# Altium project JBC_PD_Soldering_Iron.PrjPcb
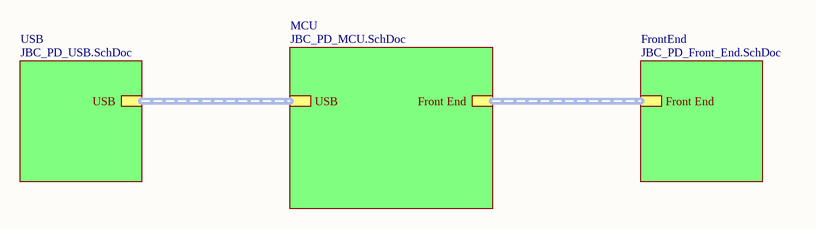
[diagram p0: JBC_PD_Top.SchDoc]
4 sheets, 83 parts. Net scope: hierarchical (ports join the sheet entries above them; power ports are global).
Board file: JBC_PD.PcbDoc
Sheets:
  JBC_PD_Top.SchDoc
    MCU = JBC_PD_MCU.SchDoc
    FrontEnd = JBC_PD_Front_End.SchDoc
    USB = JBC_PD_USB.SchDoc

## Sheet JBC_PD_Top.SchDoc
size A4

### Sub-sheets
FrontEnd = JBC_PD_Front_End.SchDoc: Front End (harness Front End)
MCU = JBC_PD_MCU.SchDoc: USB (harness USB), Front End (harness Front End)
USB = JBC_PD_USB.SchDoc: USB (harness USB)

### Buses and harness runs
harness sheet FrontEnd/Front End = sheet MCU/Front End
harness sheet MCU/USB = sheet USB/USB

## Sheet JBC_PD_MCU.SchDoc
size A4
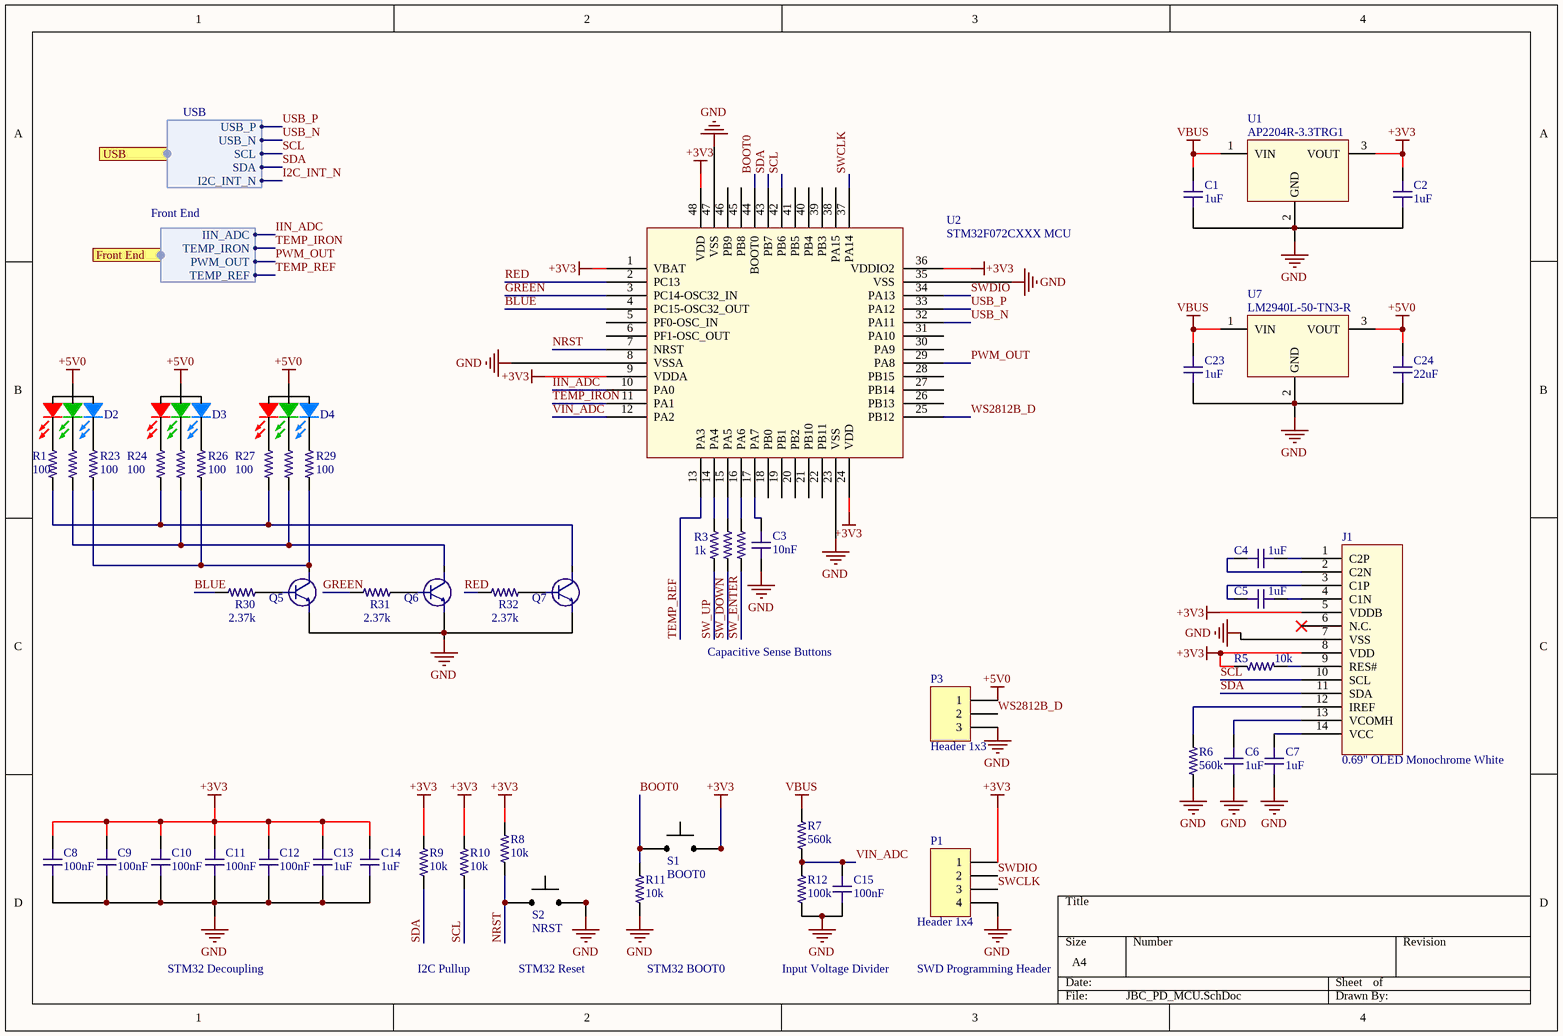
[diagram p1: JBC_PD_MCU.SchDoc]

### Parts
C1  value 1uF  [C0603-IPC]  (hidden comment: C0603 1uF 25V X7R)
C2  value 1uF  [C0603-IPC]  (hidden comment: C0603 1uF 25V X7R)
C3  value 10nF  [C0603-IPC]  (hidden comment: Cs 10nF 50V X7R)
C4  value 1uF  [C0603-IPC]  (hidden comment: C0603 1uF 25V X7R)
C5  value 1uF  [C0603-IPC]  (hidden comment: C0603 1uF 25V X7R)
C6  value 1uF  [C0603-IPC]  (hidden comment: C0603 1uF 25V X7R)
C7  value 1uF  [C0603-IPC]  (hidden comment: C0603 1uF 25V X7R)
C8  value 100nF  [C0603-IPC]  (hidden comment: C0603 100nF 25V X7R)
C9  value 100nF  [C0603-IPC]  (hidden comment: C0603 100nF 25V X7R)
C10  value 100nF  [C0603-IPC]  (hidden comment: C0603 100nF 25V X7R)
C11  value 100nF  [C0603-IPC]  (hidden comment: C0603 100nF 25V X7R)
C12  value 100nF  [C0603-IPC]  (hidden comment: C0603 100nF 25V X7R)
C13  value 1uF  [C0603-IPC]  (hidden comment: C0603 1uF 25V X7R)
C14  value 1uF  [C0603-IPC]  (hidden comment: C0603 1uF 25V X7R)
C15  value 100nF  [C0603-IPC]  (hidden comment: C0603 100nF 25V X7R)
C23  value 1uF  [C0603-IPC]  (hidden comment: C0603 1uF 25V X7R)
C24  value 22uF  [C0603-IPC]  (hidden comment: C0603 22uF 10V X5R)
D2  RGB  [LED_0606_RGB_WURTH - Reverse Mount]  (value not drawn)
D3  RGB  [LED_0606_RGB_WURTH - Reverse Mount]  (value not drawn)
D4  RGB  [LED_0606_RGB_WURTH - Reverse Mount]  (value not drawn)
J1  0.69" OLED Monochrome White  [OLED_64x32 Bent]
P1  Header 1x4  [HEADER 1X4 SMD 2.54mm]
P3  Header 1x3  [HEADER 1X3 SMD 2.54mm]
Q5  MMBT3904LT1G  [SOT23-MMBT3904]  (value not drawn)
Q6  MMBT3904LT1G  [SOT23-MMBT3904]  (value not drawn)
Q7  MMBT3904LT1G  [SOT23-MMBT3904]  (value not drawn)
R1  value 100  [R0603-IPC]  (hidden comment: R0603 100 1%)
R2  R0603 1K 1%  [R0603-IPC]  (value not drawn)
R3  value 1k  [R0603-IPC]  (hidden comment: R0603 1K 1%)
R4  R0603 1K 1%  [R0603-IPC]  (value not drawn)
R5  value 10k  [R0603-IPC]  (hidden comment: R0603 10K 1%)
R6  value 560k  [R0603-IPC]  (hidden comment: R0603 560K 1%)
R7  value 560k  [R0603-IPC]  (hidden comment: R0603 560K 1%)
R8  value 10k  [R0603-IPC]  (hidden comment: R0603 10K 1%)
R9  value 10k  [R0603-IPC]  (hidden comment: R0603 10K 1%)
R10  value 10k  [R0603-IPC]  (hidden comment: R0603 10K 1%)
R11  value 10k  [R0603-IPC]  (hidden comment: R0603 10K 1%)
R12  value 100k  [R0603-IPC]  (hidden comment: R0603 100K 1%)
R22  R0603 100 1%  [R0603-IPC]  (value not drawn)
R23  value 100  [R0603-IPC]  (hidden comment: R0603 100 1%)
R24  value 100  [R0603-IPC]  (hidden comment: R0603 100 1%)
R25  R0603 100 1%  [R0603-IPC]  (value not drawn)
R26  value 100  [R0603-IPC]  (hidden comment: R0603 100 1%)
R27  value 100  [R0603-IPC]  (hidden comment: R0603 100 1%)
R28  R0603 100 1%  [R0603-IPC]  (value not drawn)
R29  value 100  [R0603-IPC]  (hidden comment: R0603 100 1%)
R30  value 2.37k  [R0603-IPC]  (hidden comment: R0603 2.37K 1%)
R31  value 2.37k  [R0603-IPC]  (hidden comment: R0603 2.37K 1%)
R32  value 2.37k  [R0603-IPC]  (hidden comment: R0603 2.37K 1%)
S1  BOOT0  [TL3342F260QG]
S2  NRST  [TL3342F260QG]
U1  AP2204R-3.3TRG1  [SOT-89]
U2  STM32F072CXXX MCU  [LQFP48]
U7  LM2940L-50-TN3-R  [DPAK2]

### Ports
Front End (harness Front End), USB (harness USB)

### Harnesses
USB: USB_P, USB_N, SCL, SDA, I2C_INT_N
Front End: IIN_ADC, TEMP_IRON, PWM_OUT, TEMP_REF

### Nets
+3V3: C2.1 C8.2 C9.2 C10.2 C11.2 C12.2 C13.1 C14.1 J1.5(VDDB) J1.8(VDD) P1.1 R5.1 R8.2 R9.2 R10.2 S1.1 S1.2 U1.3(VOUT) U2.1(VBAT) U2.9(VDDA) U2.24(VDD) U2.36(VDDIO2) U2.48(VDD)
+5V0: C24.2 D2.A D3.A D4.A P3.1 U7.3(VOUT)
GND: C1.2 C2.2 C3.1 C6.2 C7.2 C8.1 C9.1 C10.1 C11.1 C12.1 C13.2 C14.2 C15.1 C23.2 C24.1 J1.7(VSS) P1.4 P3.3 Q5.2(E) Q6.2(E) Q7.2(E) R6.1 R11.1 R12.1 S2.1 S2.2 U1.2(GND) U2.8(VSSA) U2.23(VSS) U2.35(VSS) U2.47(VSS) U7.2(GND)
VBUS: C1.1 C23.1 R7.2 U1.1(VIN) U7.1(VIN)
BLUE: R30.1 U2.4(PC15-OSC32_OUT)
BOOT0: R11.2 S1.3 S1.4 U2.44(BOOT0)
GREEN: R31.1 U2.3(PC14-OSC32_IN)
IIN_ADC: U2.10(PA0) ; port Front End.IIN_ADC
NRST: R8.1 S2.3 S2.4 U2.7(NRST)
PWM_OUT: U2.29(PA8) ; port Front End.PWM_OUT
RED: R32.1 U2.2(PC13)
SCL: J1.10(SCL) R10.1 U2.42(PB6) ; port USB.SCL
SDA: J1.11(SDA) R9.1 U2.43(PB7) ; port USB.SDA
SW_DOWN: R2.1
SW_ENTER: R4.1
SW_UP: R3.1
SWCLK: P1.3 U2.37(PA14)
SWDIO: P1.2 U2.34(PA13)
TEMP_IRON: U2.11(PA1) ; port Front End.TEMP_IRON
TEMP_REF: U2.13(PA3) ; port Front End.TEMP_REF
USB_N: U2.32(PA11) ; port USB.USB_N
USB_P: U2.33(PA12) ; port USB.USB_P
VIN_ADC: C15.2 R7.1 R12.2 U2.12(PA2)
WS2812B_D: P3.2 U2.25(PB12)
NetC3_2: C3.2 U2.17(PA7)
NetC4_1: C4.1 J1.2(C2N)
NetC4_2: C4.2 J1.1(C2P)
NetC5_1: C5.1 J1.3(C1P)
NetC5_2: C5.2 J1.4(C1N)
NetC6_1: C6.1 J1.13(VCOMH)
NetC7_1: C7.1 J1.14(VCC)
NetD2_BK: D2.BK R23.2
NetD2_GK: D2.GK R22.2
NetD2_RK: D2.RK R1.2
NetD3_BK: D3.BK R26.2
NetD3_GK: D3.GK R25.2
NetD3_RK: D3.RK R24.2
NetD4_BK: D4.BK R29.2
NetD4_GK: D4.GK R28.2
NetD4_RK: D4.RK R27.2
NetJ1_9: J1.9(RES#) R5.2
NetJ1_12: J1.12(IREF) R6.2
NetQ5_1: Q5.1(B) R30.2
NetQ5_3: Q5.3(C) R23.1 R26.1 R29.1
NetQ6_1: Q6.1(B) R31.2
NetQ6_3: Q6.3(C) R22.1 R25.1 R28.1
NetQ7_1: Q7.1(B) R32.2
NetQ7_3: Q7.3(C) R1.1 R24.1 R27.1
NetR2_2: R2.2 U2.15(PA5)
NetR3_2: R3.2 U2.14(PA4)
NetR4_2: R4.2 U2.16(PA6)

Not connected (* = marked no-connect by the designer): J1 6(N.C.)*; U2 5(PF0-OSC_IN) 6(PF1-OSC_OUT) 18(PB0) 19(PB1) 20(PB2) 21(PB10) 22(PB11) 26(PB13) 27(PB14) 28(PB15) 30(PA9) 31(PA10) 38(PA15) 39(PB3) 40(PB4) 41(PB5) 45(PB8) 46(PB9)

### Notes on the sheet
- Capacitive Sense Buttons
- STM32 Decoupling
- I2C Pullup
- STM32 Reset
- STM32 BOOT0
- Input Voltage Divider
- SWD Programming Header

### Library data of the parts
C1 C2 C4-C7 C13 C14 C23 = C0603 1uF 25V X7R: CAP CER 1UF 25V X7R 0603; EIA Code: X7R; Max. Voltage: 25V; Features: Soft Termination; Supplier 1: Digi-Key; Supplier Part Number 1: 445-173615-1-ND
C3 = C0603 10nF 50V X7R: CAP CER 10000PF 50V X7R 0603; EIA Code: X7R; Max. Voltage: 50V; Features: Soft Termination; Supplier 1: Digi-Key; Supplier Part Number 1: 490-10892-1-ND
C8-C12 C15 = C0603 100nF 25V X7R: Chip Capacitor, 0603, 100nF, 25V, X7R; EIA Code: X7R; Max. Voltage: 25V; Supplier 1: Digi-Key; Supplier Part Number 1: 490-1524-1-ND
C24 = C0603 22uF 10V X5R: Chip Capacitor, 0603, 22uF, 10V, X5R; EIA Code: X5R; Max. Voltage: 10V; Supplier 1: Digi-Key; Supplier Part Number 1: 490-10476-1-ND
D2-D4 = Led_RGB_0606: RGB Led 1.6 x 1.6 mm Diffused; Manufacturer: Everlight; Manufacturer Part Number: 19-237/R6GHBHW-C01/2T; Supplier 1: Digi-Key; Supplier Part Number 1: 1080-1590-1-ND
J1 = OLED_64x32: 0.69" OLED Direct Solder Monochrome White; Manufacturer Part Number: UG-9616TSWCG02; Supplier 1: LCSC; Supplier Part Number 1: C88335
P1 = Header 1x4: Header, 4-Pin; LatestRevisionDate: 17-Jul-2002; LatestRevisionNote: Re-released for DXP Platform.; Publisher: Altium Limited
P3 = Header 1x3: Header, 3-Pin; LatestRevisionDate: 17-Jul-2002; LatestRevisionNote: Re-released for DXP Platform.; Publisher: Altium Limited
Q5-Q7 = MMBT3904LT1G: Bipolar (BJT) Transistor NPN 40V 200mA 300MHz 300mW Surface Mount SOT-23-3 (TO-236); I_max: 200mA; V_brkdown: 40V; Supplier 1: Digi-Key; Supplier 2: Mouser; Supplier 3: LCSC; Supplier Part Number 1: MMBT3904LT1GOSDKR-ND; Supplier Part Number 2: 863-MMBT3904LT1G; Supplier Part Number 3: C81464
R1 R23 R24 R26 R27 R29 = R0603 100 1%: RES SMD 100 OHM 1% 1/4W 0603; Power (Watts): 0.25W, 1/4W; Supplier 1: Digi-Key; Supplier Part Number 1: 541-3244-1-ND
R2-R4 = R0603 1K 1%: RES SMD 1K OHM 1% 1/10W 0603; Temperature Coefficient: ±100ppm/°C; Operating Temperature: -55°C ~ 155°C; Features: Automotive AEC-Q200; Tolerance: ±1%; Supplier 1: Digi-Key; Supplier Part Number 1: RMCF0603FG1K00CT-ND
  R2 R4: Value: 1k
R5 R8-R11 = R0603 10K 1%: RES SMD 10K OHM 1% 1/10W 0603; Supplier 1: Digi-Key; Supplier Part Number 1: RMCF0603FT10K0CT-ND
R6 R7 = R0603 560K 1%: RES 560K OHM 1% 1/10W 0603; Supplier 1: Digi-Key; Supplier Part Number 1: RMCF0603FT560KCT-ND
R12 = R0603 100K 1%: RES SMD 100K OHM 1% 1/10W 0603; Supplier 1: Digi-Key; Supplier Part Number 1: RMCF0603FT100KCT-ND
R22 R25 R28 = R0603 100 1%: RES SMD 100 OHM 1% 1/4W 0603; Power (Watts): 0.25W, 1/4W; Value: 100; Supplier 1: Digi-Key; Supplier Part Number 1: 541-3244-1-ND
R30-R32 = R0603 2.37K 1%: RES SMD 2.37K OHM 1% 1/10W 0603; Supplier 1: Digi-Key; Supplier 2: Mouser; Supplier 3: LCSC; Supplier Part Number 3: C403087; Supplier Part Number 2: 667-ERJ-3EKF2371V; Supplier Part Number 1: P2.37KHCT-ND
S1 S2 = SWITCH TACTILE SPST: SWITCH TACTILE SPST-NO 0.05A 12V; Manufacturer Part Number: TL3342F260QG; Supplier 1: Digi-Key; Supplier Part Number 1: EG5470CT-ND
U1 = AP2204R: Fixed 24V 3.3V 150mA SOT-89(SOT-89-3) Low Dropout Regulators(LDO); Supplier 1: Digi-Key; Supplier 2: Mouser; Supplier 3: LCSC; Supplier Part Number 1: AP2204R-3.3TRG1DICT-ND; Supplier Part Number 2: 621-AP2204R-3.3TRG1; Supplier Part Number 3: C156303
U2 = STM32F072CXXX: 32-Bit FLASH ARM® Cortex®-M0 48MHz 1.65V ~ 3.6V LQFP-48_7x7x05P ST Microelectronics RoHS; Supplier 1: Digi-Key; Supplier 2: Mouser; Supplier 3: LCSC; Supplier Part Number 1: 497-18747-1-ND; Supplier Part Number 2: 511-STM32F072CBT6TR; Supplier Part Number 3: C81720
U7 = LM2940L-50-TN3-R: Fixed 26V 5V 1A TO-252-2(DPAK) Low Dropout Regulators(LDO); Supplier 3: LCSC; Supplier Part Number 3: C85225

## Sheet JBC_PD_Front_End.SchDoc
size A4
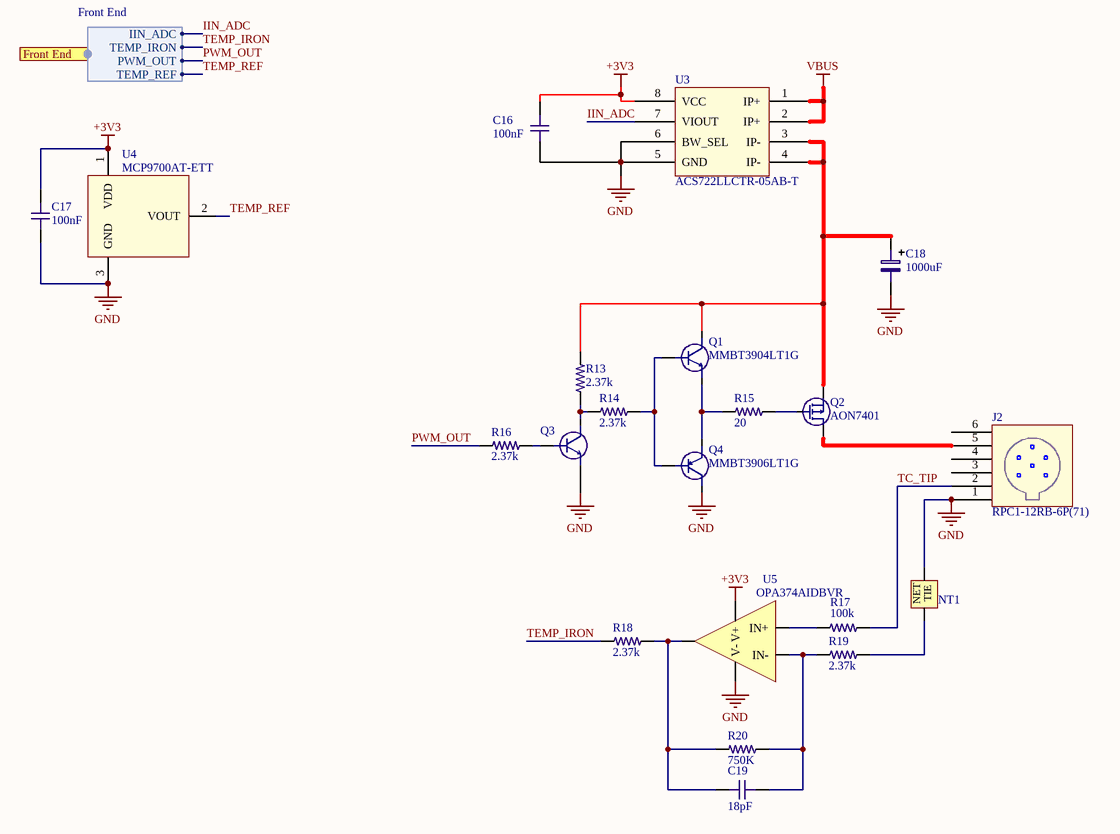
[diagram p2: JBC_PD_Front_End.SchDoc]

### Parts
C16  value 100nF  [C0603-IPC]  (hidden comment: C0603 100nF 25V X7R)
C17  value 100nF  [C0603-IPC]  (hidden comment: C0603 100nF 25V X7R)
C18  value 1000uF  [C-POLARIZED-5-12.5 Horizontal]  (hidden comment: 35ZLH1000MEFC12.5X20)
C19  value 18pF  [C0402-IPC]  (hidden comment: C0402 18pF 50V C0G_1)
J2  RPC1-12RB-6P(71)  [HIROSE RPC 1 SMD (WIRE)]
NT1  Net Tie  [NET_TIE]  (value not drawn)  (net tie, no BOM)
Q1  MMBT3904LT1G  [SOT23-MMBT3904]
Q2  AON7401  [DFN3x3A_8L_EP1_P]
Q3  MMBT3904LT1G  [SOT23-MMBT3904]  (value not drawn)
Q4  MMBT3906LT1G  [SOT23-Generic]
R13  value 2.37k  [R0603-IPC]  (hidden comment: R0603 2.37K 1%)
R14  value 2.37k  [R0603-IPC]  (hidden comment: R0603 2.37K 1%)
R15  value 20  [R1206-IPC]  (hidden comment: R1206 20 1%)
R16  value 2.37k  [R0603-IPC]  (hidden comment: R0603 2.37K 1%)
R17  value 100k  [R0603-IPC]  (hidden comment: R0603 100K 1%)
R18  value 2.37k  [R0603-IPC]  (hidden comment: R0603 2.37K 1%)
R19  value 2.37k  [R0603-IPC]  (hidden comment: R0603 2.37K 1%)
R20  value 750K  [R0603-IPC]  (hidden comment: RC0603FR-07750KL)
U3  ACS722LLCTR-05AB-T  [SOIC127P600X175-8N]
U4  MCP9700AT-ETT  [SOT23]
U5  OPA374AIDBVR  [DBV0005A]

### Ports
Front End (harness Front End)

### Harnesses
Front End: IIN_ADC, TEMP_IRON, PWM_OUT, TEMP_REF

### Nets
+3V3: C16.2 C17.2 U3.8(VCC) U4.1(VDD) U5.5(V+)
GND: C16.1 C17.1 C18.2 J2.1 NT1.2 Q3.2(E) Q4.3(C) U3.5(GND) U3.6(BW_SEL) U4.3(GND) U5.2(V-)
VBUS: U3.1(IP+) U3.2(IP+)
IIN_ADC: U3.7(VIOUT) ; port Front End.IIN_ADC
PWM_OUT: R16.1 ; port Front End.PWM_OUT
TC_TIP: J2.2 R17.1
TEMP_IRON: R18.1 ; port Front End.TEMP_IRON
TEMP_REF: U4.2(VOUT) ; port Front End.TEMP_REF
NetC18_1: C18.1 Q1.3(C) Q2.S R13.2 U3.3(IP-) U3.4(IP-)
NetC19_1: C19.1 R18.2 R20.1 U5.1(VOUT)
NetC19_2: C19.2 R19.1 R20.2 U5.4(IN-)
NetJ2_5: J2.5 Q2.D
NetNT1_1: NT1.1 R19.2
NetQ1_1: Q1.1(B) Q4.1(B) R14.2
NetQ1_2: Q1.2(E) Q4.2(E) R15.1
NetQ2_G: Q2.G R15.2
NetQ3_1: Q3.1(B) R16.2
NetQ3_3: Q3.3(C) R13.1 R14.1
NetR17_2: R17.2 U5.3(IN+)

Not connected (* = marked no-connect by the designer): J2 3 4 6

### Notes on the sheet
- (in symbol Net Tie) TIE; NET

### Library data of the parts
C16 C17 = C0603 100nF 25V X7R: Chip Capacitor, 0603, 100nF, 25V, X7R; EIA Code: X7R; Max. Voltage: 25V; Supplier 1: Digi-Key; Supplier Part Number 1: 490-1524-1-ND
C18 = C-THT 1000uF 35V Electrolytic: 1000uF ±20% 35V 12.5x20 10000Hrs @ 105℃ Radial,12.5x20mm Aluminum Electrolytic Capacitors - Leaded RoHS; Supplier 1: Digi-Key; Supplier 2: Mouser; Supplier 3: LCSC; Supplier Part Number 1: 1189-1888-ND; Supplier Part Number 2: 232-LH1000MEFC125X20; Supplier Part Number 3: C338194
C19 = C0402 18pF 50V C0G_1: Chip Capacitor, 0402, 18pF, 25V, C0G; Max. Voltage: 25V; Supplier 1: Digi-Key; Supplier Part Number 1: 399-14427-1-ND; EIA Code: C0G
J2 = Hirose RPC1: 6 Position Circular Connector Receptacle, Male Pins Solder Cup (JBC Iron Conn); Supplier 1: Digi-Key; Supplier 2: Mouser; Supplier Part Number 1: HR1817-ND; Supplier Part Number 2: 798-RPC112RB6P71
Q1 Q3 = MMBT3904LT1G: as Q5 on sheet JBC_PD_MCU; I_max: 200mA; V_brkdown: 40V; Supplier 1: Digi-Key; Supplier 2: Mouser; Supplier 3: LCSC; Supplier Part Number 1: MMBT3904LT1GOSDKR-ND; Supplier Part Number 2: 863-MMBT3904LT1G; Supplier Part Number 3: C81464
Q2 = AON7401: P-Channel 30V 12A (Ta), 35A (Tc) 3.1W (Ta), 29W (Tc) Surface Mount 8-DFN (3x3); Supplier 1: Digi-Key; Supplier 3: LCSC; Supplier Part Number 3: C124890; Supplier Part Number 1: 785-1302-1-ND
Q4 = MMBT3906LT1G: Bipolar (BJT) Transistor PNP 40V 200mA 250MHz 300mW Surface Mount SOT-23-3 (TO-236); Supplier 1: Digi-Key; Supplier 2: Mouser; Supplier 3: LCSC; Supplier Part Number 1: MMBT3906LT1GOSCT-ND; Supplier Part Number 2: 863-MMBT3906LT1G; Supplier Part Number 3: C53444
R13 R14 R16 R18 R19 = R0603 2.37K 1%: RES SMD 2.37K OHM 1% 1/10W 0603; Supplier 1: Digi-Key; Supplier 2: Mouser; Supplier 3: LCSC; Supplier Part Number 3: C403087; Supplier Part Number 2: 667-ERJ-3EKF2371V; Supplier Part Number 1: P2.37KHCT-ND
R15 = R1206 20 1%: Chip Resistor, 1206, 20 ohms, 0.5W; Manufacturer: Stackpole Electronics Inc.; Manufacturer Part Number: RNCP1206FTD20R0; Supplier 1: Digi-Key; Supplier Part Number 1: RNCP1206FTD20R0CT-ND
R17 = R0603 100K 1%: RES SMD 100K OHM 1% 1/10W 0603; Supplier 1: Digi-Key; Supplier Part Number 1: RMCF0603FT100KCT-ND
R20 = R0603 750K 1%: RES SMD 750K OHM 1% 1/10W 0603; Temperature Coefficient: ±100ppm/°C; Tolerance: ±1%; Operating Temperature: -55°C ~ 155°C; Supplier 1: Digi-Key; Supplier 2: Mouser; Supplier 3: LCSC; Supplier Part Number 1: 311-750KHRCT-ND; Supplier Part Number 2: 603-RC0603FR-07750KL; Supplier Part Number 3: C137684
U3 = ACS722: Current Sensor 5A 1 Channel Hall Effect, Open Loop Bidirectional 8-SOIC (0.154", 3.90mm Width); Supplier 1: Digi-Key; Supplier Part Number 1: 620-1634-1-ND; Supplier 3: LCSC; Supplier Part Number 3: C116613
U4 = MCP9700AT-ETT: Temperature Sensor Analog, Local -40°C ~ 125°C 10mV/°C SOT-23-3; Supplier 1: Digi-Key; Supplier 2: Mouser; Supplier 3: LCSC; Supplier Part Number 1: MCP9700AT-E/TTCT-ND; Supplier Part Number 2: 579-MCP9700AT-E/TT; Supplier Part Number 3: C127949
U5 = OPA374: General Purpose 1 2.3V ~ 5.5V, ±1.15V ~ 2.75V 585uA 6.5MHz 5 V/us SOT-23-5 Precision OpAmps RoHS; Supplier 1: Digi-Key; Supplier 2: Mouser; Supplier 3: LCSC; Supplier Part Number 1: 296-39129-1-ND; Supplier Part Number 2: 595-OPA374AIDBVR; Supplier Part Number 3: C111859

## Sheet JBC_PD_USB.SchDoc
size A4
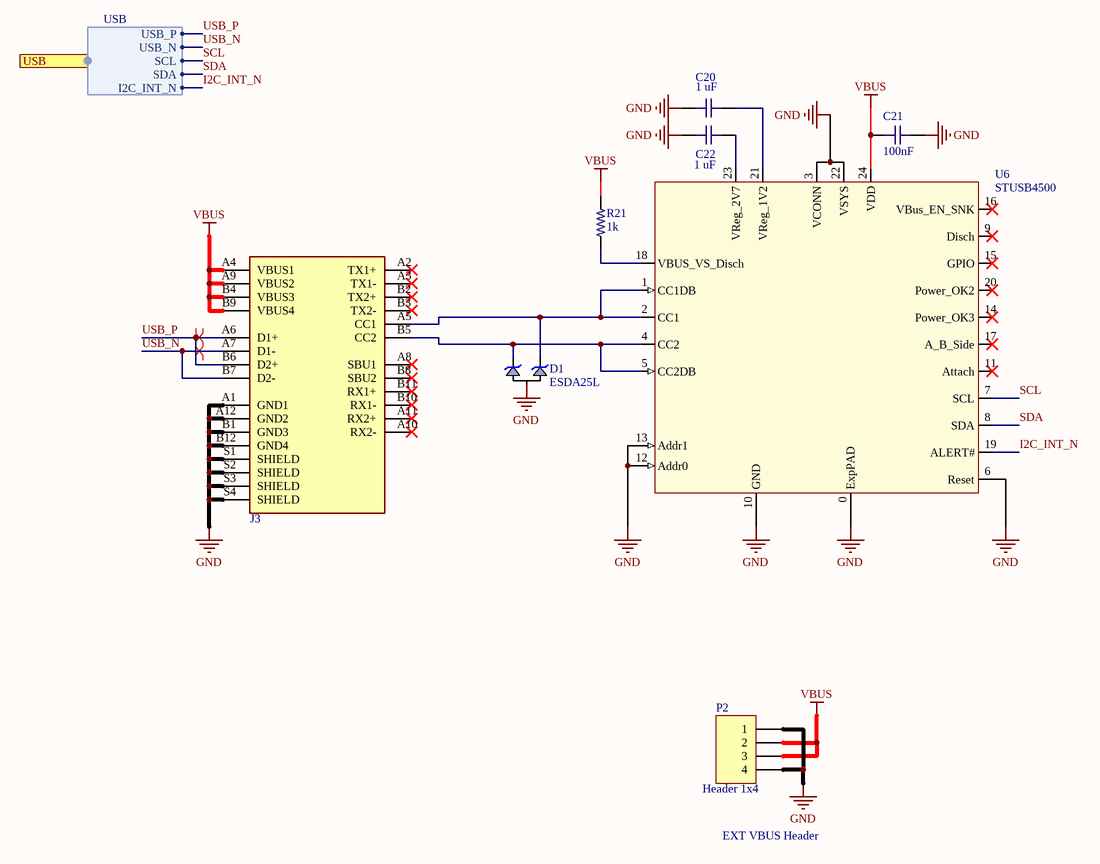
[diagram p3: JBC_PD_USB.SchDoc]

### Parts
C20  value 1 uF  [C0603-IPC]  (hidden comment: C0603 1uF 10V X7R)
C21  value 100nF  [C0603-IPC]  (hidden comment: C0603 100nF 25V X7R)
C22  value 1 uF  [C0603-IPC]  (hidden comment: C0603 1uF 10V X7R)
D1  ESDA25L  [SOT23-3L]
J3  USB C  [Molex USB-C]  (value not drawn)
P2  Header 1x4  [HEADER 1X4 SMD 2.54mm]
R21  value 1k  [R0603-IPC]  (hidden comment: R0603 1K 1%)
U6  STUSB4500  [QFN24 - 4X4MM - PITCH 0.5MM - EXPOSEDPAD]

### Ports
USB (harness USB)

### Harnesses
USB: USB_P, USB_N, SCL, SDA, I2C_INT_N

### Nets
GND: C20.1 C21.2 C22.1 D1.3(A) J3.A1(GND1) J3.A12(GND2) J3.B1(GND3) J3.B12(GND4) J3.S1(SHIELD) J3.S2(SHIELD) J3.S3(SHIELD) J3.S4(SHIELD) P2.1 P2.4 U6.0(ExpPAD) U6.3(VCONN) U6.6(Reset) U6.10(GND) U6.12(Addr0) U6.13(Addr1) U6.22(VSYS)
VBUS: C21.1 J3.A4(VBUS1) J3.A9(VBUS2) J3.B4(VBUS3) J3.B9(VBUS4) P2.2 P2.3 R21.2 U6.24(VDD)
I2C_INT_N: U6.19(ALERT#) ; port USB.I2C_INT_N
SCL: U6.7(SCL) ; port USB.SCL
SDA: U6.8(SDA) ; port USB.SDA
USB_N: J3.A7(D1-) J3.B7(D2-) ; port USB.USB_N
USB_P: J3.A6(D1+) J3.B6(D2+) ; port USB.USB_P
NetC20_2: C20.2 U6.21(VReg_1V2)
NetC22_2: C22.2 U6.23(VReg_2V7)
NetD1_1: D1.1(K1) J3.A5(CC1) U6.1(CC1DB) U6.2(CC1)
NetD1_2: D1.2(K2) J3.B5(CC2) U6.4(CC2) U6.5(CC2DB)
NetR21_1: R21.1 U6.18(VBUS_VS_Disch)

Not connected (* = marked no-connect by the designer): J3 A2(TX1+)* A3(TX1-)* A8(SBU1)* A10(RX2-)* A11(RX2+)* B2(TX2+)* B3(TX2-)* B8(SBU2)* B10(RX1-)* B11(RX1+)*; U6 9(Disch)* 11(Attach)* 14(Power_OK3)* 15(GPIO)* 16(VBus_EN_SNK)* 17(A_B_Side)* 20(Power_OK2)*

### Layout directives
differential pair: USB_N, USB_P

### Notes on the sheet
- EXT VBUS Header

### Library data of the parts
C20 C22 = C0603 1uF 10V X7R: Chip Capacitor, 0603, 1uF +/- 0.1uF, 10V, X7R; Supplier 1: Digi-Key; Supplier Part Number 1: 1276-1946-1-ND; Max. Voltage: 10V; EIA Code: X7R
C21 = C0603 100nF 25V X7R: Chip Capacitor, 0603, 100nF, 25V, X7R; EIA Code: X7R; Max. Voltage: 25V; Supplier 1: Digi-Key; Supplier Part Number 1: 490-1524-1-ND
D1 = ESDA25L: Dual Transil Array For ESD Protection in SOT23-3 Vbr = 25V; Manufacturer: STMicroelectronics; Supplier 1: Digi-Key; Supplier 2: Mouser; Supplier 3: LCSC; Supplier Part Number 1: 497-4642-1-ND; Supplier Part Number 2: 511-ESDA25L; Supplier Part Number 3: C95343; Manufacturer Part Number: ESDA25L
J3 = USB C: USB-C USB 3.1 Gen 2, Superspeed+_ Receptacle Connector 24 Position Surface Mount, Right Angle; Through Hole; MF: Molex; MP: 1054500101; Package: None; Digi-Key_Part_Number: WM12856CT-ND; SnapEDA_Link: https://www.snapeda.com/parts/1054500101/Molex/view-part/448528/?ref=snap; Digi-Key_Purchase_URL: https://www.digikey.tw/product-detail/en/molex/1054500101/WM12856CT-ND/5843891?utm_source=snapeda&utm_medium=aggregator&utm_campaign=symbol; Value: *; Supplier 1: Digi-Key; Supplier 2: Mouser; Supplier 3: LCSC; Supplier Part Number 1: WM12856CT-ND; Supplier Part Number 2: 538-105450-0101; Supplier Part Number 3: C134092
P2 = Header 1x4: Header, 4-Pin; LatestRevisionDate: 17-Jul-2002; LatestRevisionNote: Re-released for DXP Platform.; Publisher: Altium Limited
R21 = R0603 1K 1%: as R2 on sheet JBC_PD_MCU; Operating Temperature: -55°C ~ 155°C; Features: Automotive AEC-Q200; Tolerance: ±1%; Supplier 1: Digi-Key; Supplier Part Number 1: RMCF0603FG1K00CT-ND
U6 = STUSB4500QTR: Standalone USB PD controller  with SINK auto-run mode in QFN24 4x4mm; Manufacturer: STMicroelectronics; Part Number: Standalone USB PD controller  with SINK auto-run mode in QFN24 4x4mm; Manufacturer’s ordering code: STUSB4500QTR; Value: STUSB4500; Supplier 1: Digi-Key; Supplier 2: Mouser; Supplier Part Number 1: 497-18060-1-ND; Supplier Part Number 2: 511-STUSB4500QTR

## Nets that join several sheets
+3V3: JBC_PD_MCU (23 pins), JBC_PD_Front_End (5 pins)
GND: JBC_PD_MCU (32 pins), JBC_PD_Front_End (11 pins), JBC_PD_USB (21 pins)
VBUS: JBC_PD_MCU (5 pins), JBC_PD_Front_End (U3.1 U3.2), JBC_PD_USB (9 pins)
IIN_ADC: JBC_PD_MCU (U2.10), JBC_PD_Front_End (U3.7)
PWM_OUT: JBC_PD_MCU (U2.29), JBC_PD_Front_End (R16.1)
SCL: JBC_PD_MCU (J1.10 R10.1 U2.42), JBC_PD_USB (U6.7)
SDA: JBC_PD_MCU (J1.11 R9.1 U2.43), JBC_PD_USB (U6.8)
TEMP_IRON: JBC_PD_MCU (U2.11), JBC_PD_Front_End (R18.1)
TEMP_REF: JBC_PD_MCU (U2.13), JBC_PD_Front_End (U4.2)
USB_N: JBC_PD_MCU (U2.32), JBC_PD_USB (J3.A7 J3.B7)
USB_P: JBC_PD_MCU (U2.33), JBC_PD_USB (J3.A6 J3.B6)